# EAGLE design motordrive1 (EAGLE 7.3.0)
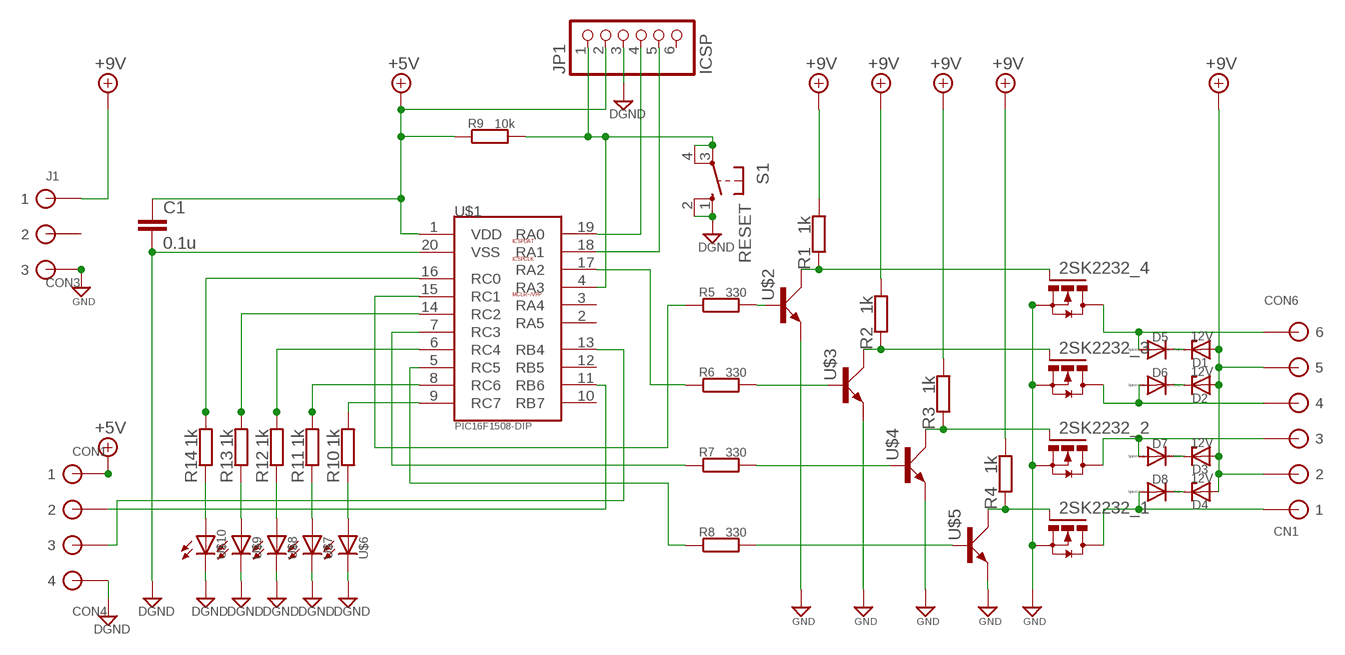
[diagram p0: schematic, sheet 1]

## Parts
2SK2232_1  TO-220(MOS-FET_N)  [TO-220]
2SK2232_2  TO-220(MOS-FET_N)  [TO-220]
2SK2232_3  TO-220(MOS-FET_N)  [TO-220]
2SK2232_4  TO-220(MOS-FET_N)  [TO-220]
C1  0.1u  コンデンサ(小型極性無し)050-024X044  [C050-024X044]
CN1  CON6  [CON6]
CON1  CON4  [CON4]
D1  12V  (汎用)ツェナーダイオードD=3  [DO41Z(D=3)]
D2  12V  (汎用)ツェナーダイオードD=3  [DO41Z(D=3)]
D3  12V  (汎用)ツェナーダイオードD=3  [DO41Z(D=3)]
D4  12V  (汎用)ツェナーダイオードD=3  [DO41Z(D=3)]
D5  (汎用)D=3  [DO41(D=3)]
D6  (汎用)D=3  [DO41(D=3)]
D7  (汎用)D=3  [DO41(D=3)]
D8  (汎用)D=3  [DO41(D=3)]
J1  CON3  [CON3]
JP1  ICSP  PINHD-1X6  [1X06]
R1  1k  抵抗(新JIS)0207/10  [0207/10]
R2  1k  抵抗(新JIS)0207/10  [0207/10]
R3  1k  抵抗(新JIS)0207/10  [0207/10]
R4  1k  抵抗(新JIS)0207/10  [0207/10]
R5  330  抵抗0207/10  [1/4W-H4_(0207/10)]
R6  330  抵抗0207/10  [1/4W-H4_(0207/10)]
R7  330  抵抗0207/10  [1/4W-H4_(0207/10)]
R8  330  抵抗0207/10  [1/4W-H4_(0207/10)]
R9  10k  抵抗0207/10  [1/4W-H4_(0207/10)]
R10  1k  抵抗(新JIS)0207/10  [0207/10]
R11  1k  抵抗(新JIS)0207/10  [0207/10]
R12  1k  抵抗(新JIS)0207/10  [0207/10]
R13  1k  抵抗(新JIS)0207/10  [0207/10]
R14  1k  抵抗(新JIS)0207/10  [0207/10]
S1  RESET  ノーマル4ピンタクトスイッチ  [B3F-10XX]
U$1  PIC16F1508-DIP  [DIP254P762X533-20]
U$2  TO-92(TRANSISTER_NPN)  [TO-92]
U$3  TO-92(TRANSISTER_NPN)  [TO-92]
U$4  TO-92(TRANSISTER_NPN)  [TO-92]
U$5  TO-92(TRANSISTER_NPN)  [TO-92]
U$6  LED(砲弾型)5  [LED5MM]
U$7  LED(砲弾型)5  [LED5MM]
U$8  LED(砲弾型)5  [LED5MM]
U$9  LED(砲弾型)5  [LED5MM]
U$10  LED(砲弾型)5  [LED5MM]

## Nets
+5V: C1.1 CON1.P$1 JP1.2 R9.1 U$1.1(VDD)
+9V: CN1.P$2 CN1.P$5 D1.A D2.A D3.A D4.A J1.P$1 R1.2 R2.2 R3.2 R4.2
DGND: C1.2 CON1.P$4 JP1.3 S1.1(S) S1.2(S1) U$1.20(VSS) U$6.K U$7.K U$8.K U$9.K U$10.K
GND: 2SK2232_1.3(S) 2SK2232_2.3(S) 2SK2232_3.3(S) 2SK2232_4.3(S) J1.P$3 U$2.1(E) U$3.1(E) U$4.1(E) U$5.1(E)
N$1: 2SK2232_1.2(D) CN1.P$1 D8.A
N$2: 2SK2232_2.2(D) CN1.P$3 D7.A
N$3: 2SK2232_3.2(D) CN1.P$4 D6.A
N$4: 2SK2232_4.2(D) CN1.P$6 D5.A
N$5: R8.1 U$1.5(RC5)
N$6: R5.1 U$1.15(RC1)
N$7: R7.1 U$1.7(RC3)
N$8: 2SK2232_3.1(G) R2.1 U$3.2(C)
N$9: CON1.P$2 U$1.11(RB6)
N$10: CON1.P$3 U$1.13(RB4)
N$11: 2SK2232_4.1(G) R1.1 U$2.2(C)
N$12: R6.1 U$1.17(RA2)
N$13: 2SK2232_2.1(G) R3.1 U$4.2(C)
N$14: 2SK2232_1.1(G) R4.1 U$5.2(C)
N$15: R5.2 U$2.3(B)
N$16: R6.2 U$3.3(B)
N$17: R7.2 U$4.3(B)
N$18: R8.2 U$5.3(B)
N$19: JP1.4 U$1.19(RA0)
N$20: JP1.5 U$1.18(RA1)
N$21: JP1.1 R9.2 S1.3(P) S1.4(P1) U$1.4(RA3)
N$23: R10.1 U$6.A
N$24: R10.2 U$1.9(RC7)
N$25: R11.2 U$1.8(RC6)
N$26: R12.2 U$1.6(RC4)
N$27: R13.2 U$1.14(RC2)
N$28: R14.2 U$1.16(RC0)
N$29: R11.1 U$7.A
N$30: R12.1 U$8.A
N$31: R13.1 U$9.A
N$32: D1.C D5.C
N$33: D2.C D6.C
N$34: D3.C D7.C
N$35: D4.C D8.C
N$36: R14.1 U$10.A
Unconnected: J1.P$2 JP1.6 U$1.2(RA5) U$1.3(RA4) U$1.10(RB7) U$1.12(RB5)

## Library data of the parts
2SK2232_1-2SK2232_4 = (半導体)FET＆トランジスタ:TO-220(MOS-FET_N)
C1 = 0RCL:コンデンサ(小型極性無し): CAPACITOR, European symbol
CN1 = _XH-con(XHｺﾈｸﾀ):CON6: low insertion connector 6
CON1 = _XH-con(XHｺﾈｸﾀ):CON4: Low insertion connector 4pin
D1-D4 = (半導体)ダイオード:(汎用)ツェナーダイオード: Z DIODE 3.3 V, 1W, 5 percent
D5-D8 = (半導体)ダイオード:(汎用): DIODE general purpose rectifier, 1 A
J1 = (コネクタ)XH:CON3: low insertion CON
JP1 = (コネクタ)ピンヘッダ:PINHD-1X6: PIN HEADER
R1-R4 R10-R14 = 0RCL:抵抗(新JIS): RESISTOR, European symbol
R5-R9 = (Foundation)抵抗:抵抗: RESISTOR, European symbol
S1 = (スイッチ)タクトスイッチ:ノーマル4ピンタクトスイッチ: OMRON SWITCH; MPN: B3F-1000; OC_FARNELL: 176432; OC_NEWARK: 36M3542
U$1 = (マイコン)PIC:PIC16F1508-DIP
U$2-U$5 = (半導体)FET＆トランジスタ:TO-92(TRANSISTER_NPN)
U$6-U$10 = (半導体)LED:LED(砲弾型)

## Board
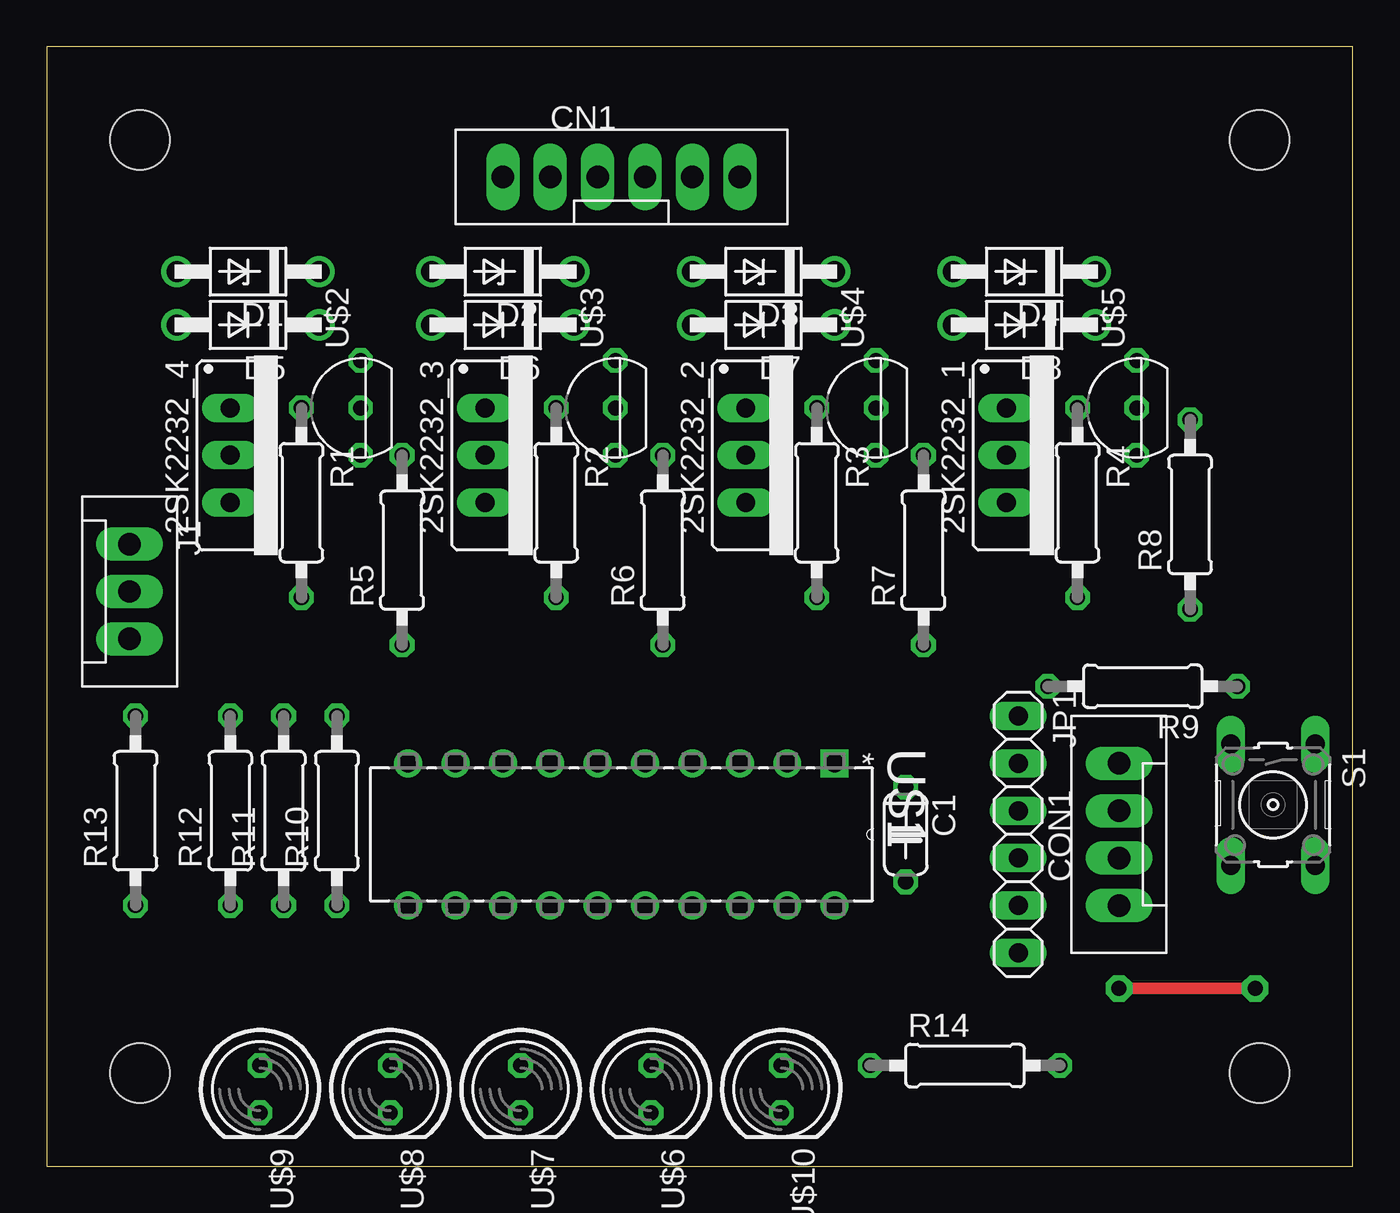
[diagram p1: board, top side]
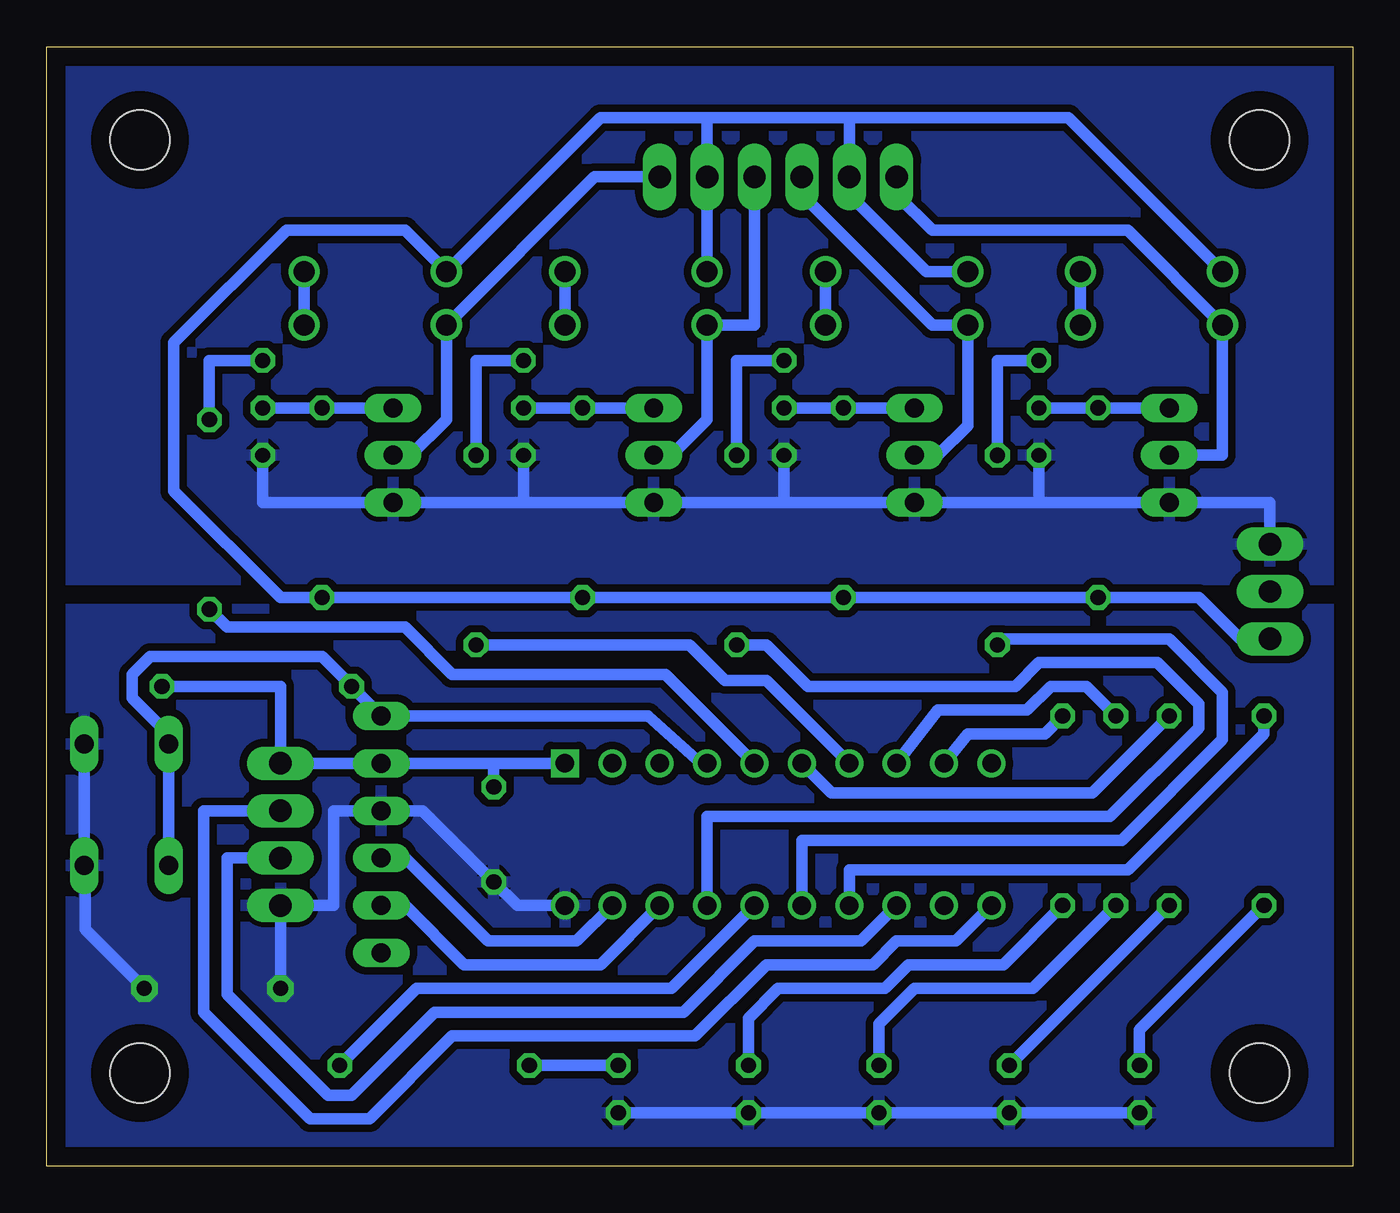
[diagram p2: board, bottom side, seen from below]

Size 70 x 60 mm. Coordinates in mm from the lower left corner, seen from the top.
Outline: 0,0 70,0 70,60 0,60 0,0
Copper layers (1*16): Top 0.035mm / dielectric 1.5mm / Bottom 0.035mm
Design rules "default": minimum track width 10mil, minimum drill 24mil, track to track 8mil, track to pad 8mil, pad to pad 8mil, via to via 8mil, smd to smd 8mil, copper to edge 40mil, drill to drill 8mil, minimum pad ring 10mil, minimum via ring 8mil, stop-mask expansion 4mil, vias tented up to drill 0mil, thermal gap 10mil
Holes 3.2 mm at 5,55 65,55 65,5 5,5

### Footprints (pad centres in the part's own frame; a part is rotated, then mirrored left to right if it is on the bottom)
TO-220 = drill 1.016 long: 1 -2.54,0; 2 0,0; 3 2.54,0
C050-024X044 = drill 0.813 octagon: 1 -2.54,0; 2 2.54,0
CON6 = drill 1.2 long: P$1 6.35,0; P$2 3.81,0; P$3 1.27,0; P$4 -1.27,0; P$5 -3.81,0; P$6 -6.35,0
CON4 = drill 1.2 long: P$1 3.81,0; P$2 1.27,0; P$3 -1.27,0; P$4 -3.81,0
DO41Z(D=3) = drill 1.118: A 3.81,0; C -3.81,0
DO41(D=3) = drill 1.118: A 3.81,0; C -3.81,0
CON3 = drill 1.2 long: P$1 2.54,0; P$2 0,0; P$3 -2.54,0
1X06 = drill 1.016 long: 1 -6.35,0; 2 -3.81,0; 3 -1.27,0; 4 1.27,0; 5 3.81,0; 6 6.35,0
0207/10 = drill 0.813 octagon: 1 -5.08,0; 2 5.08,0
1/4W-H4_(0207/10) = drill 0.813 octagon: 1 -5.08,0; 2 5.08,0
B3F-10XX = drill 1.016 long: 1 -3.251,2.261; 2 3.251,2.261; 3 -3.251,-2.261; 4 3.251,-2.261
DIP254P762X533-20 = drill 0.991 square: 1 -7.62,22.86 | drill 0.991: 2 -7.62,20.32; 3 -7.62,17.78; 4 -7.62,15.24; 5 -7.62,12.7; 6 -7.62,10.16; 7 -7.62,7.62; 8 -7.62,5.08; 9 -7.62,2.54; 10 -7.62,0; 11 0,0; 12 0,2.54; 13 0,5.08; 14 0,7.62; 15 0,10.16; 16 0,12.7; 17 0,15.24; 18 0,17.78; 19 0,20.32; 20 0,22.86
TO-92 = drill 0.8 octagon: 1 -2.54,0; 2 0,0; 3 2.54,0
LED5MM = drill 0.813 octagon: A -1.27,0; K 1.27,0

### Placement (x,y rotation side)
2SK2232_1  51.44,38.1 270 top
2SK2232_2  37.47,38.1 270 top
2SK2232_3  23.5,38.1 270 top
2SK2232_4  9.84,38.1 270 top
C1  46.04,17.78 270 top
CN1  30.8,53.02 0 top
CON1  57.47,17.78 90 top
D1  10.79,47.94 180 top
D2  24.45,47.94 180 top
D3  38.42,47.94 180 top
D4  52.39,47.94 180 top
D5  10.79,45.09 180 top
D6  24.45,45.09 180 top
D7  38.42,45.09 180 top
D8  52.39,45.09 180 top
J1  4.45,30.8 270 top
JP1  52.07,17.78 270 top
R1  13.65,35.56 270 top
R2  27.3,35.56 270 top
R3  41.27,35.56 270 top
R4  55.24,35.56 270 top
R5  19.05,33.02 90 top
R6  33.02,33.02 90 top
R7  46.99,33.02 90 top
R8  61.28,34.92 90 top
R9  58.74,25.72 180 top
R10  15.56,19.05 90 top
R11  12.7,19.05 90 top
R12  9.84,19.05 90 top
R13  4.76,19.05 90 top
R14  49.21,5.4 0 top
S1  65.72,19.37 270 top
U$1  19.37,13.97 270 top
U$2  16.83,40.64 90 top
U$3  30.48,40.64 90 top
U$4  44.45,40.64 90 top
U$5  58.42,40.64 90 top
U$6  32.38,4.13 270 top
U$7  25.4,4.13 270 top
U$8  18.41,4.13 270 top
U$9  11.43,4.13 270 top
U$10  39.37,4.13 270 top

### Tracks (layer width: path | path; a pad name or v marks a point on that pad's centre or on a via)
+5V
  Bottom 0.61: CON1.P$1 46.04,21.59 | 46.04,21.59 U$1.1 | C1.1 46.04,21.59 | JP1.2 CON1.P$1 | R9.1 57.47,25.72 CON1.P$1
+9V
  Bottom 0.61: D2.A 22.86,47.94 26.99,52.07 CN1.P$5 26.99,56.2 | D3.A CN1.P$2 34.61,56.2 | 34.61,56.2 26.99,56.2 | 34.61,56.2 40.32,56.2 D4.A 50.8,50.16 57.15,50.16 63.18,44.13 63.18,36.2 57.47,30.48 R4.2 R3.2 R2.2 R1.2 8.26,30.48 6.03,28.26 J1.P$1 | 26.99,56.2 15.24,56.2 D1.A
DGND  (via drill 0.8 pad 1.42)
  Top 0.61: v57.47,9.53 v64.77,9.53
  Bottom 0.61: U$10.K U$6.K U$7.K U$8.K U$9.K | S1.1 S1.2 67.94,16.08 67.94,12.7 v64.77,9.53 | U$1.20 44.77,13.97 C1.2 49.85,19.05 JP1.3 54.61,19.05 54.61,13.97 CON1.P$4 v57.47,9.53
  pour Bottom (isolate 0.406): 0,29.84 70.17,29.84 70.17,0 0,0
GND
  Bottom 0.61: 16.83,35.56 2SK2232_4.3 4.45,35.56 J1.P$3 | 16.83,35.56 2SK2232_3.3 30.48,35.56 | 16.83,35.56 U$2.1 | 30.48,35.56 2SK2232_2.3 44.45,35.56 | U$3.1 30.48,35.56 | 44.45,35.56 U$4.1 | 44.45,35.56 2SK2232_1.3 58.42,35.56 U$5.1
  pour Bottom (isolate 0.406): 0,60.33 70.17,60.33 70.17,31.43 0,31.43
N$1
  Bottom 0.61: 2SK2232_1.2 50.48,38.1 48.58,40.01 D8.A 40.64,53.02 CN1.P$1
N$2
  Bottom 0.61: 2SK2232_2.2 36.51,38.1 34.61,40.01 D7.A 32.07,45.09 CN1.P$3
N$3
  Bottom 0.61: 2SK2232_3.2 22.23,38.1 20.64,39.69 D6.A 22.54,45.09 29.53,52.07 CN1.P$4
N$4
  Bottom 0.61: 2SK2232_4.2 6.99,38.1 D5.A 12.06,50.16 22.54,50.16 24.45,52.07 CN1.P$6
N$5
  Bottom 0.61: U$1.5 36.83,26.35 48.26,26.35 50.8,28.89 60.33,28.89 R8.1
N$6
  Bottom 0.61: U$1.15 29.53,17.46 12.38,17.46 6.99,22.86 6.99,25.4 9.84,28.26 18.73,28.26 R5.1
N$7
  Bottom 0.61: U$1.7 31.43,26.04 33.66,26.04 35.56,27.94 R7.1
N$8
  Bottom 0.61: 2SK2232_3.1 R2.1 U$3.2
N$9
  Bottom 0.61: U$1.11 21.27,12.06 24.45,12.06 25.72,10.79 31.43,10.79 35.24,6.99 48.26,6.99 52.7,2.54 55.88,2.54 61.59,8.26 61.59,19.05 CON1.P$2
N$10
  Bottom 0.61: U$1.13 26.35,12.06 32.07,12.06 35.88,8.26 49.21,8.26 53.66,3.81 54.93,3.81 60.33,9.21 60.33,16.51 CON1.P$3
N$11
  Bottom 0.61: 2SK2232_4.1 R1.1 U$2.2
N$12
  Bottom 0.61: U$1.17 34.61,18.73 13.02,18.73 8.26,23.5 8.26,24.77 10.48,26.99 16.83,26.99 18.1,25.72 29.21,25.72 31.43,27.94 R6.1
N$13
  Bottom 0.61: 2SK2232_2.1 R3.1 U$4.2
N$14
  Bottom 0.61: 2SK2232_1.1 R4.1 U$5.2
N$15
  Bottom 0.61: U$2.3 19.05,43.18 R5.2
N$16
  Bottom 0.61: U$3.3 33.02,43.18 R6.2
N$17
  Bottom 0.61: U$4.3 46.99,43.18 R7.2
N$18
  Bottom 0.61: U$5.3 61.28,43.18 R8.2
N$19
  Bottom 0.61: JP1.4 50.8,16.51 46.35,12.06 41.59,12.06 U$1.19
N$20
  Bottom 0.61: U$1.18 40.32,10.79 47.62,10.79 50.8,13.97 JP1.5
N$21
  Bottom 0.61: U$1.4 34.92,21.59 37.78,24.13 JP1.1 | S1.4 S1.3 63.5,23.18 65.41,25.08 65.41,26.35 64.45,27.3 55.24,27.3 JP1.1 | JP1.1 R9.2
N$23
  Bottom 0.61: R10.1 18.73,10.79 23.81,10.79 25.08,9.53 30.8,9.53 32.38,7.94 U$6.A
N$24
  Bottom 0.61: U$1.9 20.64,23.18 16.51,23.18 R10.2
N$25
  Bottom 0.61: U$1.8 22.23,24.45 17.46,24.45 16.19,25.72 14.29,25.72 R11.2
N$26
  Bottom 0.61: U$1.6 27.94,20 13.97,20 R12.2
N$27
  Bottom 0.61: R13.2 4.76,23.18 12.06,15.88 26.99,15.88 U$1.14
N$28
  Bottom 0.61: U$1.16 36.51,9.53 50.16,9.53 R14.2
N$29
  Bottom 0.61: U$7.A 25.4,7.62 23.5,9.53 17.14,9.53 R11.1
N$30
  Bottom 0.61: R12.1 U$8.A
N$31
  Bottom 0.61: R13.1 11.43,7.3 U$9.A
N$32
  Bottom 0.61: D5.C D1.C
N$33
  Bottom 0.61: D2.C D6.C
N$34
  Bottom 0.61: D3.C D7.C
N$35
  Bottom 0.61: D4.C D8.C
N$36
  Bottom 0.61: R14.1 U$10.A